# Altium schematic sheet Do.SchDoc
size A4
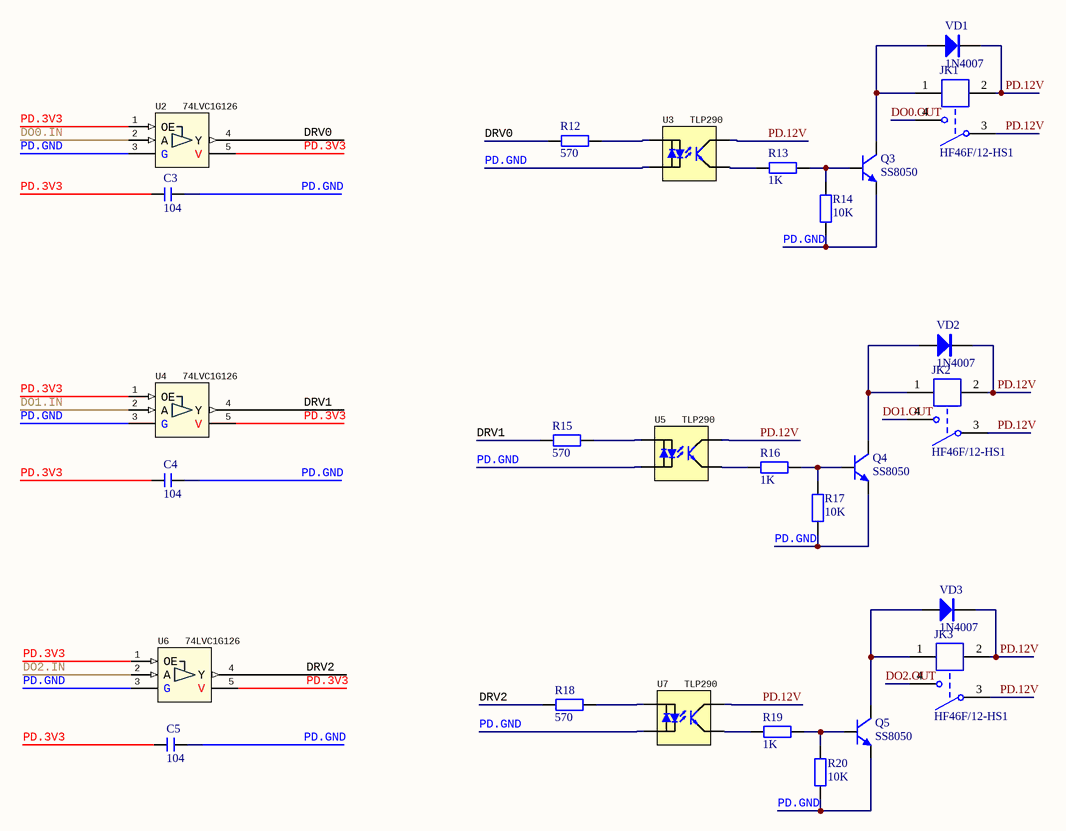
[diagram p0: Do.SchDoc]

## Parts
C3  104  [C 0603]
C4  104  [C 0603]
C5  104  [C 0603]
JK1  HF46F/12-HS1  [HF46F/12-HS1]
JK2  HF46F/12-HS1  [HF46F/12-HS1]
JK3  HF46F/12-HS1  [HF46F/12-HS1]
Q3  SS8050  [SOT23-3N]
Q4  SS8050  [SOT23-3N]
Q5  SS8050  [SOT23-3N]
R12  570  [R 0603]
R13  1K  [R 0603]
R14  10K  [R 0603]
R15  570  [R 0603]
R16  1K  [R 0603]
R17  10K  [R 0603]
R18  570  [R 0603]
R19  1K  [R 0603]
R20  10K  [R 0603]
U2  74LVC1G126  [TSSOP-5P-0.65BSC-2.15x1.40Bmax-1.10Hmax]
U3  TLP290  [SO-4-1.27BSC-4.6W-TLP]
U4  74LVC1G126  [TSSOP-5P-0.65BSC-2.15x1.40Bmax-1.10Hmax]
U5  TLP290  [SO-4-1.27BSC-4.6W-TLP]
U6  74LVC1G126  [TSSOP-5P-0.65BSC-2.15x1.40Bmax-1.10Hmax]
U7  TLP290  [SO-4-1.27BSC-4.6W-TLP]
VD1  1N4007  [SMA]
VD2  1N4007  [SMA]
VD3  1N4007  [SMA]

## Nets
DO0.IN: U2.2(A)
DO0.OUT: JK1.4
DO1.IN: U4.2(A)
DO1.OUT: JK2.4
DO2.IN: U6.2(A)
DO2.OUT: JK3.4
DRV0: R12.1 U2.4(Y)
DRV1: R15.1 U4.4(Y)
DRV2: R18.1 U6.4(Y)
PD.3V3: C3.2 C4.2 C5.2 U2.1(OE) U2.5(V) U4.1(OE) U4.5(V) U6.1(OE) U6.5(V)
PD.12V: JK1.2 JK1.3 JK2.2 JK2.3 JK3.2 JK3.3 U3.4 U5.4 U7.4 VD1.2(K) VD2.2(K) VD3.2(K)
PD.GND: C3.1 C4.1 C5.1 Q3.2(E) Q4.2(E) Q5.2(E) R14.1 R17.1 R20.1 U2.3(G) U3.2 U4.3(G) U5.2 U6.3(G) U7.2
NetJK1_1: JK1.1 Q3.3(C) VD1.1(A)
NetJK2_1: JK2.1 Q4.3(C) VD2.1(A)
NetJK3_1: JK3.1 Q5.3(C) VD3.1(A)
NetQ3_1: Q3.1(B) R13.2 R14.2
NetQ4_1: Q4.1(B) R16.2 R17.2
NetQ5_1: Q5.1(B) R19.2 R20.2
NetR12_2: R12.2 U3.1
NetR13_1: R13.1 U3.3
NetR15_2: R15.2 U5.1
NetR16_1: R16.1 U5.3
NetR18_2: R18.2 U7.1
NetR19_1: R19.1 U7.3

## Library data of the parts
C3-C5 = C: 无极性贴片电容; 版权归属: 源创客; BOM名称: 无极性贴片电容; 学习资源: www.ooocke.com
JK1-JK3 = HF46F/12-HS1: 12V一组常开; BOM名称: 12V继电器; 版权归属: 源创客; 学习资源: www.ooocke.com
Q3-Q5 = 8050-SMD: 高频放大-NPN型; 版权归属: 源创客; 属性: 40V 1.5A 1W 100MHZ; BOM名称: 高频放大-NPN型; 学习资源: www.ooocke.com
R12-R20 = R: 贴片电阻; 版权归属: 源创客; BOM名称: 贴片电阻; 学习资源: www.ooocke.com
U2 U4 U6 = 74LVC1G126: U-LVC1G126; 02_CMT: NXP GW, TM: VN; TI DCK, TM: CN; 10_Code: C55052; 11_Name: 贴装芯片_Nexperia_74LVC1G126GW
U3 U5 U7 = TLP290: U-TLP290; 10_Code: C424197; 11_Name: 贴装芯片_TLP290
VD1-VD3 = 1N4007: 整流二极管; BOM名称: 1N4148WS; 版权归属: 源创客; 学习资源: www.ooocke.com